# Altium schematic sheet 05_V5_interface.SchDoc
size A4
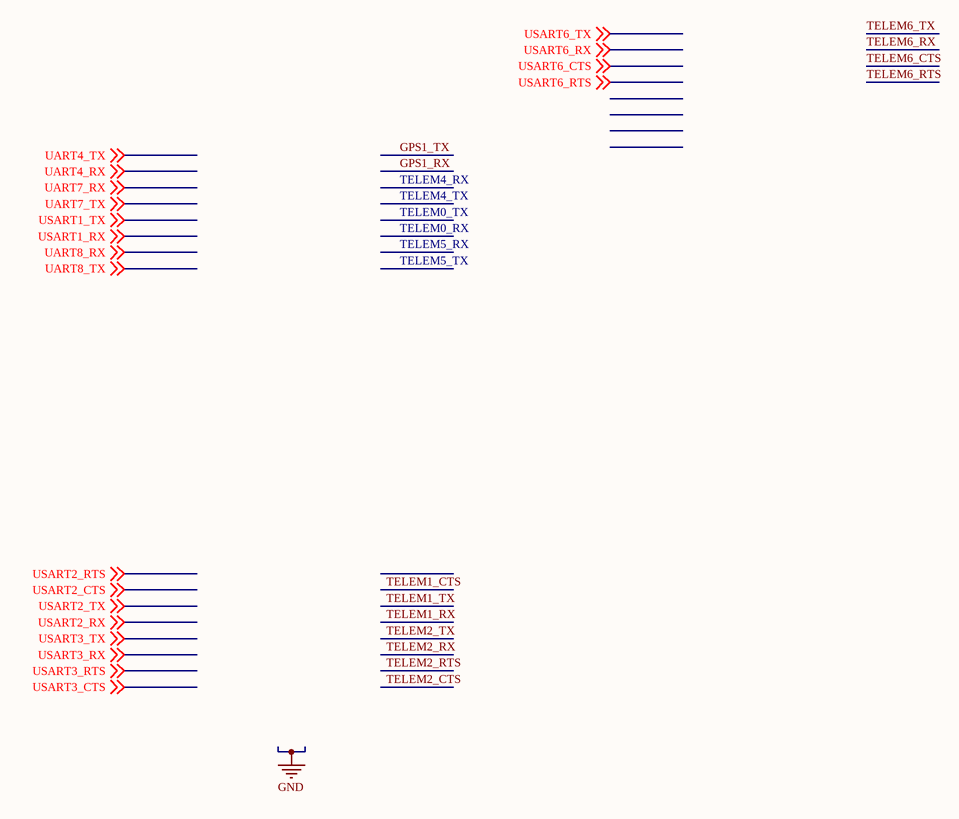
[diagram p0: 05_V5_interface.SchDoc]